# EAGLE schematic ntp-clock (EAGLE 7.6.0)
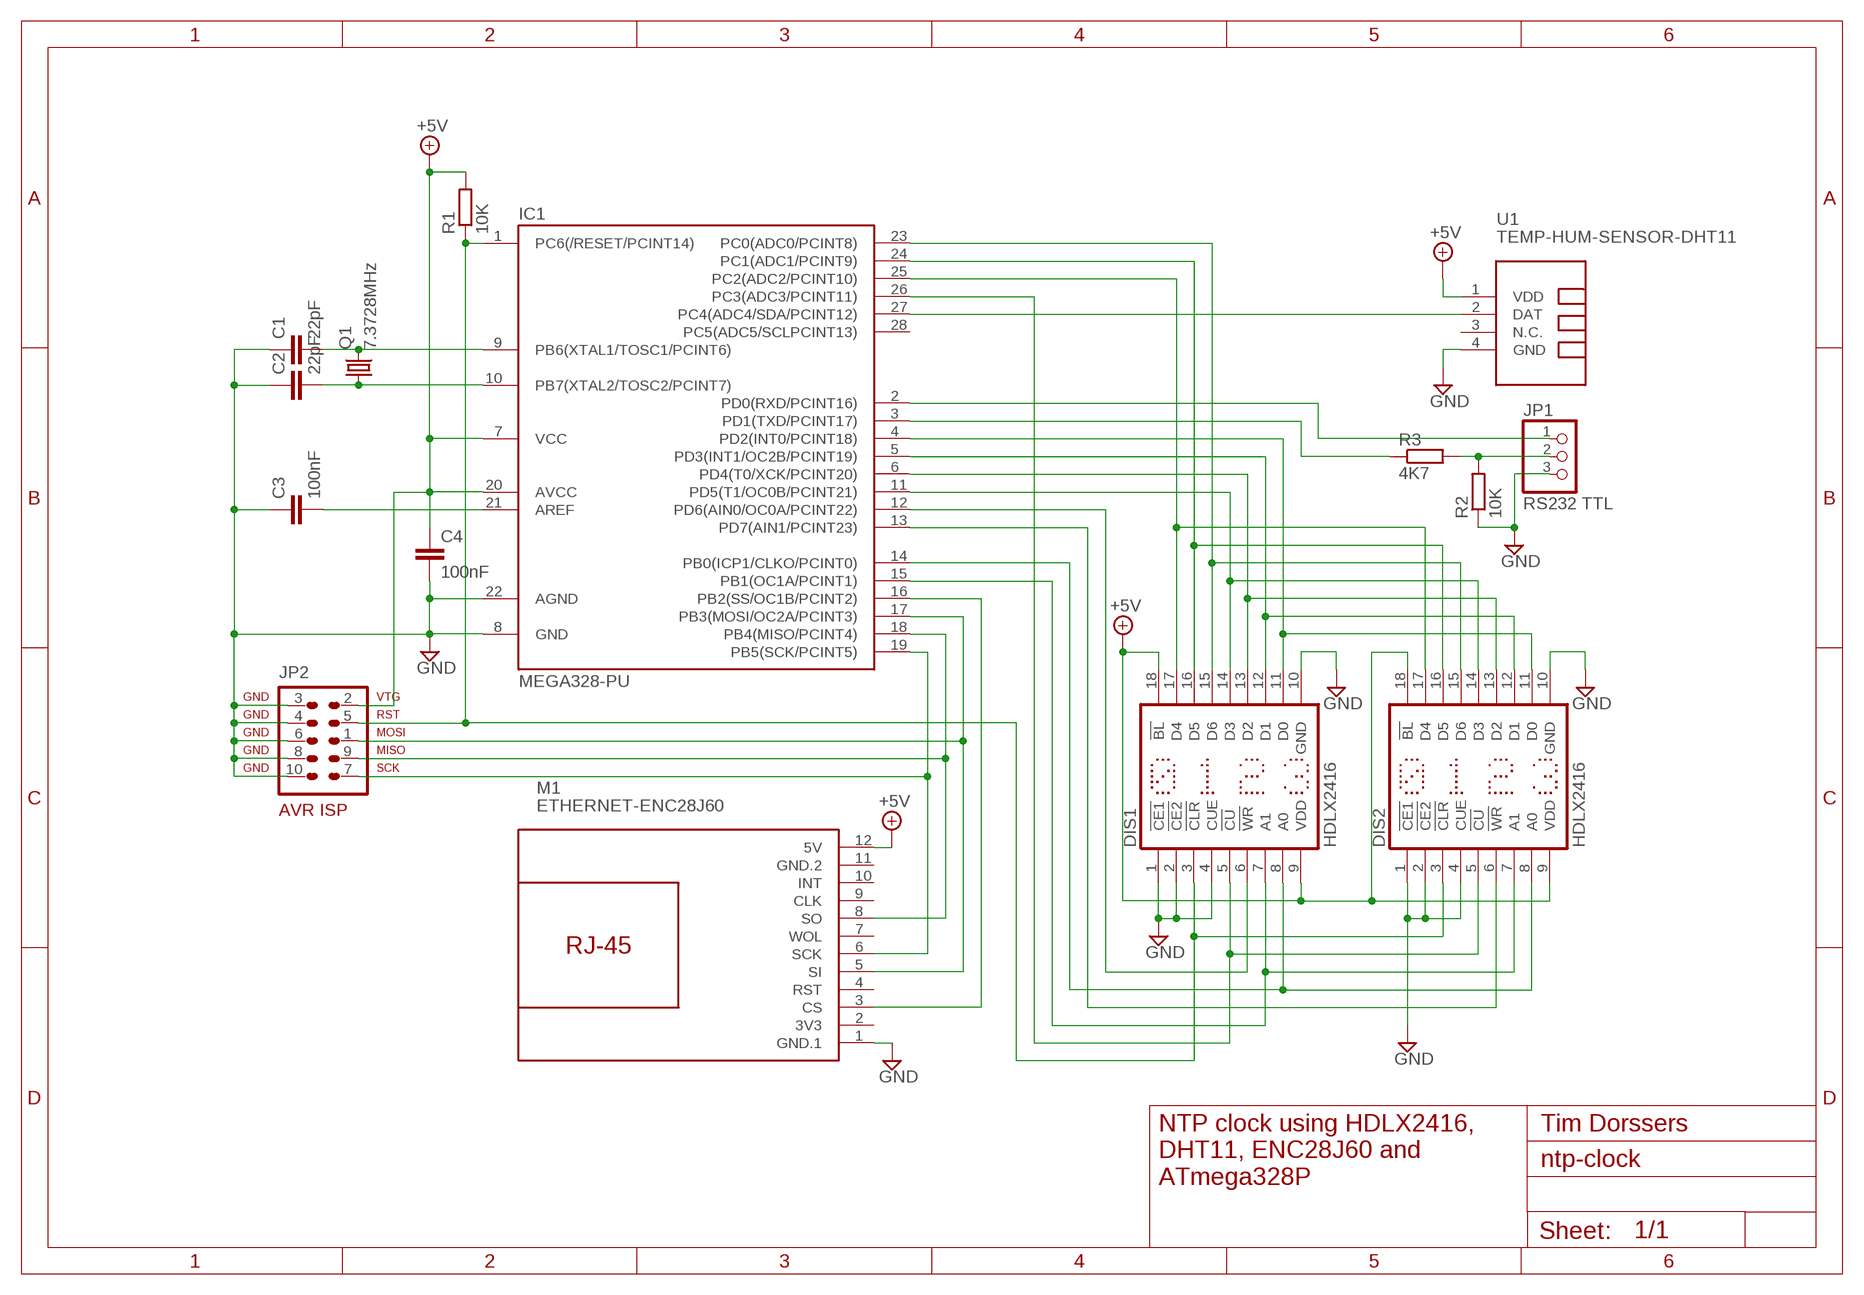
[diagram p0: schematic, sheet 1]

## Parts
C1  22pF  C-EU025-024X044  [C025-024X044]
C2  22pF  C-EU025-024X044  [C025-024X044]
C3  100nF  C-EU025-025X050  [C025-025X050]
C4  100nF  C-EU025-025X050  [C025-025X050]
DIS1  HDLX2416  [HDLX2416]
DIS2  HDLX2416  [HDLX2416]
IC1  MEGA328-PU  MEGA48/88/168-PU  [DIL28-3]
JP1  RS232 TTL  PINHD-1X3  [1X03]
JP2  AVR-ISP-10  [AVR-ISP-10]
M1  ETHERNET-ENC28J60  [ETHERNET-ENC28J60]
Q1  7.3728MHz  CRYSTALHC49S  [HC49/S]
R1  10K  R-EU_0204/7  [0204/7]
R2  10K  R-EU_0204/7  [0204/7]
R3  4K7  R-EU_0204/7  [0204/7]
U1  TEMP-HUM-SENSOR-DHT11  [TEMP-HUM-SENSOR-DHT11]

## Nets
+5V: C4.1 DIS1.9(VDD) DIS1.18(!BL) DIS2.9(VDD) DIS2.18(!BL) IC1.7(VCC) IC1.20(AVCC) JP2.2 M1.12(5V) R1.2 U1.1(VDD)
GND: C1.1 C2.1 C3.1 C4.2 DIS1.1(!CE1) DIS1.2(!CE2) DIS1.4(CUE) DIS1.10(GND) DIS2.1(!CE1) DIS2.2(!CE2) DIS2.4(CUE) DIS2.10(GND) IC1.8(GND) IC1.22(AGND) JP1.3 JP2.3 JP2.4 JP2.6 JP2.8 JP2.10 M1.1(GND.1) R2.1 U1.4(GND)
N$1: DIS1.6(!WR) IC1.12(PD6(AIN0/OC0A/PCINT22))
N$2: DIS1.3(!CLR) DIS2.3(!CLR) IC1.1(PC6(/RESET/PCINT14)) JP2.5 R1.1
N$3: DIS1.5(!CU) DIS2.5(!CU) IC1.26(PC3(ADC3/PCINT11))
N$4: DIS1.11(D0) DIS2.11(D0) IC1.4(PD2(INT0/PCINT18))
N$5: DIS1.7(A1) DIS2.7(A1) IC1.15(PB1(OC1A/PCINT1))
N$6: DIS1.8(A0) DIS2.8(A0) IC1.14(PB0(ICP1/CLKO/PCINT0))
N$7: DIS1.12(D1) DIS2.12(D1) IC1.5(PD3(INT1/OC2B/PCINT19))
N$8: DIS1.13(D2) DIS2.13(D2) IC1.6(PD4(T0/XCK/PCINT20))
N$9: DIS1.14(D3) DIS2.14(D3) IC1.11(PD5(T1/OC0B/PCINT21))
N$10: DIS1.15(D6) DIS2.15(D6) IC1.23(PC0(ADC0/PCINT8))
N$11: DIS1.16(D5) DIS2.16(D5) IC1.24(PC1(ADC1/PCINT9))
N$12: DIS1.17(D4) DIS2.17(D4) IC1.25(PC2(ADC2/PCINT10))
N$13: DIS2.6(!WR) IC1.13(PD7(AIN1/PCINT23))
N$14: IC1.19(PB5(SCK/PCINT5)) JP2.7 M1.6(SCK)
N$15: IC1.18(PB4(MISO/PCINT4)) JP2.9 M1.8(SO)
N$16: IC1.17(PB3(MOSI/OC2A/PCINT3)) JP2.1 M1.5(SI)
N$17: IC1.16(PB2(SS/OC1B/PCINT2)) M1.3(CS)
N$18: IC1.27(PC4(ADC4/SDA/PCINT12)) U1.2(DAT)
N$19: IC1.3(PD1(TXD/PCINT17)) R3.1
N$20: C1.2 IC1.9(PB6(XTAL1/TOSC1/PCINT6)) Q1.2
N$21: C2.2 IC1.10(PB7(XTAL2/TOSC2/PCINT7)) Q1.1
N$22: IC1.2(PD0(RXD/PCINT16)) JP1.1
N$23: JP1.2 R2.2 R3.2
N$24: C3.2 IC1.21(AREF)
Unconnected: IC1.28(PC5(ADC5/SCLPCINT13)) M1.4(RST) M1.7(WOL) M1.9(CLK) M1.10(INT) U1.3(N.C.)

## Notes on the sheet
- Tim Dorssers
- NTP clock using HDLX2416,
  DHT11, ENC28J60 and
  ATmega328P

## Power pins joined to a net without a drawn wire
3V3: M1.2(3V3)
GND.2: M1.11(GND.2)

## Library data of the parts
C1-C4 = rcl:C-EU: CAPACITOR, European symbol
DIS1 DIS2 = display-hp:HDLX2416: LED DISPLAY 4-character dot matrix; OC_FARNELL: unknown; OC_NEWARK: unknown
IC1 = avr-7:MEGA48/88/168-PU
JP1 = pinhead:PINHD-1X3: PIN HEADER
JP2 = avr-7:AVR-ISP-10: AVR ISP-10 Serial Programming Header
M1 = diy-modules:ETHERNET-ENC28J60: Ethernet Module based on ENC28J60 chip Click here to find device on ebay.com <http://www.ebay.com/sch/end28j60+ethernet+lan+module> Note: There are many variants. Search for the proper version.
Q1 = crystal:CRYSTAL: CRYSTAL; OC_FARNELL: 1667008; OC_NEWARK: unknown
R1-R3 = rcl:R-EU_: RESISTOR, European symbol
U1 = diy-modules:TEMP-HUM-SENSOR-DHT11: DHT11 - digital humidity & temperature sensor DHT11 datasheet available here: https://akizukidenshi.com/download/ds/aosong/DHT11.pdf Click here to find device on ebay.com <http://www.ebay.com/sch/dht11+digital+sensor>